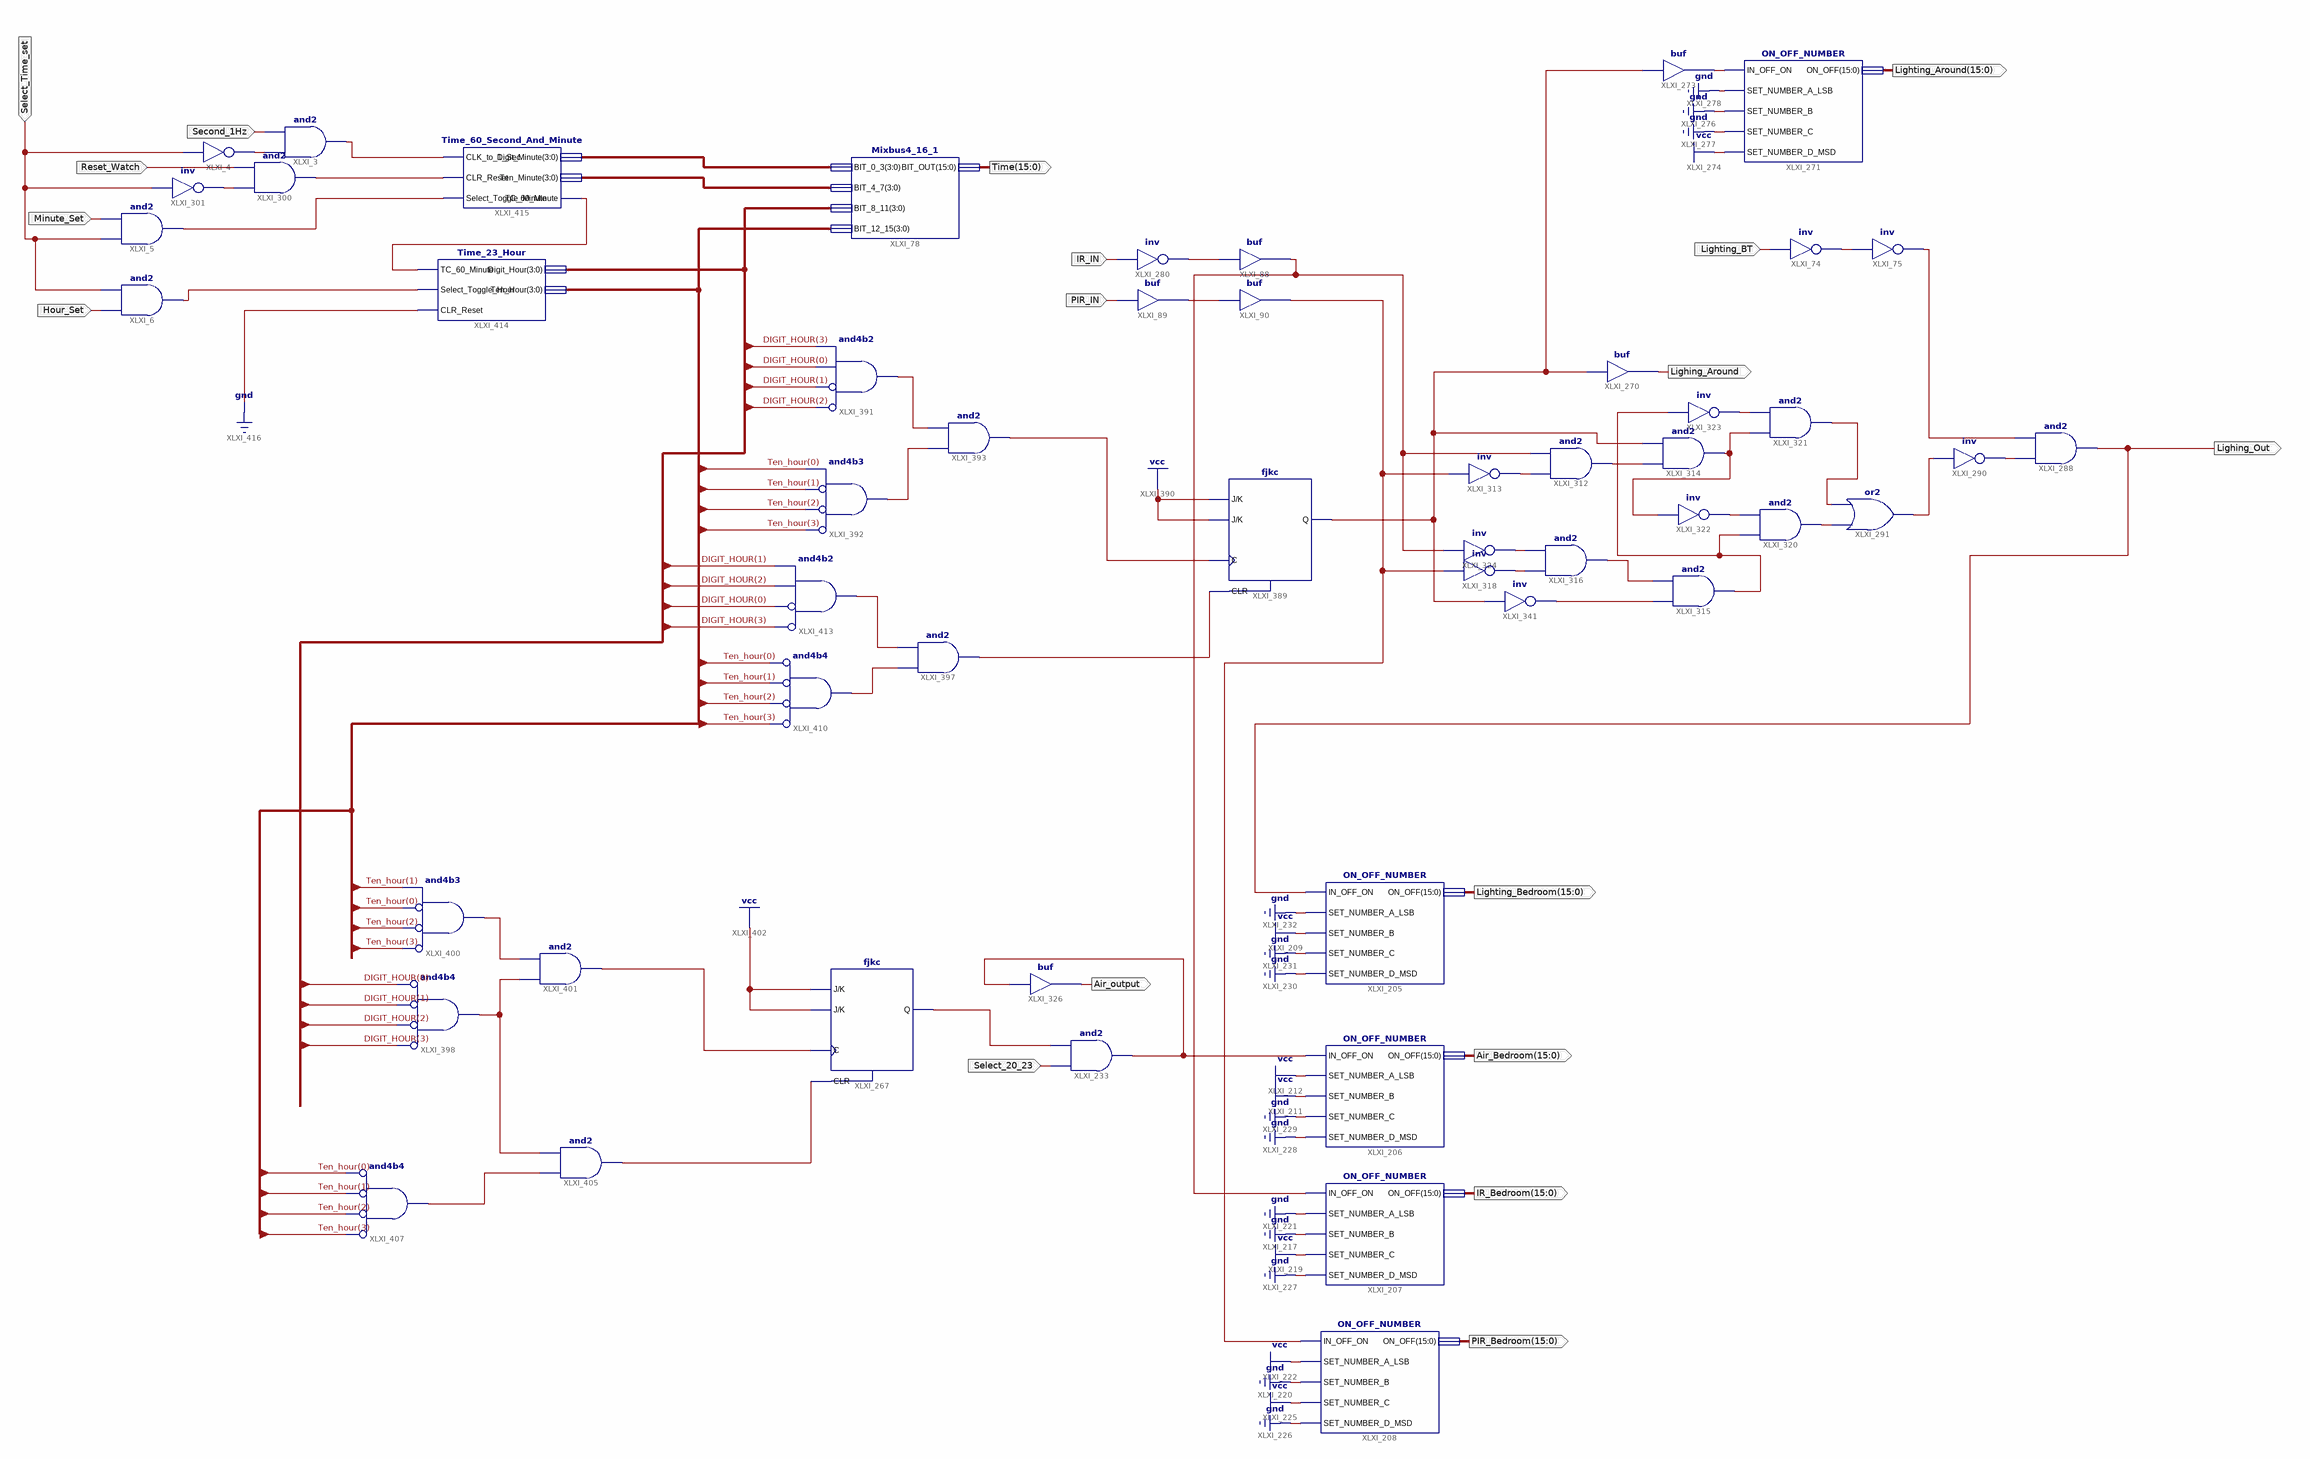
[diagram p0: schematic sheet 1]
// Xilinx ISE schematic Bedroom.sch (spartan6) as structural Verilog: 52 symbols, 18 ports
module Bedroom (
  input  Select_Time_set,
  input  Hour_Set,
  input  Second_1Hz,
  input  Minute_Set,
  input  IR_IN,
  input  PIR_IN,
  input  Lighting_BT,
  input  Select_20_23,
  input  Reset_Watch,
  output [15:0] Time,
  output Lighing_Out,
  output [15:0] Lighting_Bedroom,
  output [15:0] Air_Bedroom,
  output [15:0] IR_Bedroom,
  output [15:0] PIR_Bedroom,
  output Lighing_Around,
  output [15:0] Lighting_Around,
  output Air_output
);

  wire XLXN_6, XLXN_8, XLXN_9, XLXN_10, XLXN_143, XLXN_157, XLXN_158, XLXN_190, XLXN_358, XLXN_417, XLXN_422,
       XLXN_445, XLXN_448, XLXN_451, XLXN_463, XLXN_474, XLXN_475, XLXN_479, XLXN_482, XLXN_486, XLXN_488,
       XLXN_489, XLXN_490, XLXN_491, XLXN_494, XLXN_495, XLXN_497, XLXN_505, XLXN_525, XLXN_585, XLXN_606,
       XLXN_607, XLXN_608, XLXN_617, XLXN_618, XLXN_619, XLXN_633, XLXN_634, XLXN_635, XLXN_648, XLXN_685,
       XLXN_703;
  wire [3:0] DIGIT_HOUR, Ten_hour, XLXN_147, XLXN_148;

  and XLXI_3 (XLXN_6, XLXN_8, Second_1Hz);
  not XLXI_4 (XLXN_8, Select_Time_set);
  and XLXI_5 (XLXN_9, Select_Time_set, Minute_Set);
  and XLXI_6 (XLXN_10, Hour_Set, Select_Time_set);
  Mixbus4_16_1 XLXI_78 (
    .BIT_0_3(XLXN_147), .BIT_4_7(XLXN_148), .BIT_8_11(DIGIT_HOUR), .BIT_12_15(Ten_hour), .BIT_OUT(Time));
  buf XLXI_88 (XLXN_190, XLXN_157);
  buf XLXI_89 (XLXN_158, PIR_IN);
  buf XLXI_90 (XLXN_358, XLXN_158);
  not XLXI_74 (XLXN_143, Lighting_BT);
  not XLXI_75 (XLXN_445, XLXN_143);
  ON_OFF_NUMBER XLXI_205 (
    .IN_OFF_ON(Lighing_Out), .ON_OFF(Lighting_Bedroom), .SET_NUMBER_A_LSB(1'b0), .SET_NUMBER_B(1'b1),
    .SET_NUMBER_C(1'b0), .SET_NUMBER_D_MSD(1'b0));
  ON_OFF_NUMBER XLXI_206 (
    .IN_OFF_ON(XLXN_497), .ON_OFF(Air_Bedroom), .SET_NUMBER_A_LSB(1'b1), .SET_NUMBER_B(1'b1),
    .SET_NUMBER_C(1'b0), .SET_NUMBER_D_MSD(1'b0));
  ON_OFF_NUMBER XLXI_207 (
    .IN_OFF_ON(XLXN_190), .ON_OFF(IR_Bedroom), .SET_NUMBER_A_LSB(1'b0), .SET_NUMBER_B(1'b0),
    .SET_NUMBER_C(1'b1), .SET_NUMBER_D_MSD(1'b0));
  ON_OFF_NUMBER XLXI_208 (
    .IN_OFF_ON(XLXN_358), .ON_OFF(PIR_Bedroom), .SET_NUMBER_A_LSB(1'b1), .SET_NUMBER_B(1'b0),
    .SET_NUMBER_C(1'b1), .SET_NUMBER_D_MSD(1'b0));
  and XLXI_233 (XLXN_497, Select_20_23, XLXN_417);
  fjkc XLXI_267 (.C(XLXN_635), .CLR(XLXN_648), .J(1'b1), .K(1'b1), .Q(XLXN_417));
  ON_OFF_NUMBER XLXI_271 (
    .IN_OFF_ON(XLXN_422), .ON_OFF(Lighting_Around), .SET_NUMBER_A_LSB(1'b0), .SET_NUMBER_B(1'b0),
    .SET_NUMBER_C(1'b0), .SET_NUMBER_D_MSD(1'b1));
  buf XLXI_270 (Lighing_Around, XLXN_585);
  buf XLXI_273 (XLXN_422, XLXN_585);
  not XLXI_280 (XLXN_157, IR_IN);
  and XLXI_288 (Lighing_Out, XLXN_448, XLXN_445);
  not XLXI_290 (XLXN_448, XLXN_451);
  or XLXI_291 (XLXN_451, XLXN_486, XLXN_488);
  and XLXI_300 (XLXN_525, XLXN_463, Reset_Watch);
  not XLXI_301 (XLXN_463, Select_Time_set);
  and XLXI_312 (XLXN_475, XLXN_474, XLXN_190);
  not XLXI_313 (XLXN_474, XLXN_358);
  and XLXI_314 (XLXN_491, XLXN_475, XLXN_585);
  and XLXI_315 (XLXN_494, XLXN_505, XLXN_482);
  and XLXI_316 (XLXN_482, XLXN_479, XLXN_495);
  not XLXI_318 (XLXN_479, XLXN_358);
  and XLXI_320 (XLXN_486, XLXN_494, XLXN_489);
  and XLXI_321 (XLXN_488, XLXN_491, XLXN_490);
  not XLXI_322 (XLXN_489, XLXN_491);
  not XLXI_323 (XLXN_490, XLXN_494);
  not XLXI_324 (XLXN_495, XLXN_190);
  buf XLXI_326 (Air_output, XLXN_497);
  not XLXI_341 (XLXN_505, XLXN_585);
  fjkc XLXI_389 (.C(XLXN_608), .CLR(XLXN_619), .J(1'b1), .K(1'b1), .Q(XLXN_585));
  and XLXI_391 (XLXN_606, ~DIGIT_HOUR[2], ~DIGIT_HOUR[1], DIGIT_HOUR[0], DIGIT_HOUR[3]);  // and4b2
  and XLXI_392 (XLXN_607, ~Ten_hour[3], ~Ten_hour[2], ~Ten_hour[1], Ten_hour[0]);  // and4b3
  and XLXI_393 (XLXN_608, XLXN_607, XLXN_606);
  and XLXI_397 (XLXN_619, XLXN_618, XLXN_617);
  and XLXI_398 (XLXN_634, ~DIGIT_HOUR[3], ~DIGIT_HOUR[2], ~DIGIT_HOUR[1], ~DIGIT_HOUR[0]);  // and4b4
  and XLXI_400 (XLXN_633, ~Ten_hour[3], ~Ten_hour[2], ~Ten_hour[0], Ten_hour[1]);  // and4b3
  and XLXI_401 (XLXN_635, XLXN_634, XLXN_633);
  and XLXI_405 (XLXN_648, XLXN_685, XLXN_634);
  and XLXI_407 (XLXN_685, ~Ten_hour[3], ~Ten_hour[2], ~Ten_hour[1], ~Ten_hour[0]);  // and4b4
  and XLXI_410 (XLXN_618, ~Ten_hour[3], ~Ten_hour[2], ~Ten_hour[1], ~Ten_hour[0]);  // and4b4
  and XLXI_413 (XLXN_617, ~DIGIT_HOUR[3], ~DIGIT_HOUR[0], DIGIT_HOUR[2], DIGIT_HOUR[1]);  // and4b2
  Time_60_Second_And_Minute XLXI_415 (
    .CLK_to_1_Sec(XLXN_6), .CLR_Reset(XLXN_525), .Digit_Minute(XLXN_147), .Select_Toggle_Minute(XLXN_9),
    .TC_60_Minute(XLXN_703), .Ten_Minute(XLXN_148));
  Time_23_Hour XLXI_414 (
    .CLR_Reset(1'b0), .Digit_Hour(DIGIT_HOUR), .Select_Toggle_Hour(XLXN_10), .TC_60_Minute(XLXN_703),
    .Ten_Hour(Ten_hour));
endmodule
